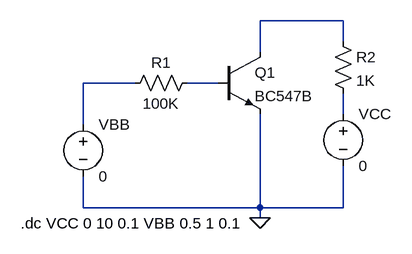
[diagram p0: schematic Common Emitter.asc]
Common Emitter.asc, the LTspice schematic file:
Version 4
SHEET 1 880 680
WIRE 608 192 480 192
WIRE 608 224 608 192
WIRE 480 240 480 192
WIRE 288 288 208 288
WIRE 416 288 368 288
WIRE 608 336 608 304
WIRE 208 352 208 288
WIRE 208 480 208 432
WIRE 480 480 480 336
WIRE 480 480 208 480
WIRE 608 480 608 416
WIRE 608 480 480 480
WIRE 480 496 480 480
FLAG 480 496 0
SYMBOL voltage 208 336 R0
SYMATTR InstName VBB
SYMATTR Value 0
SYMBOL voltage 608 320 R0
SYMATTR InstName VCC
SYMATTR Value 0
SYMBOL res 384 272 R90
WINDOW 0 0 56 VBottom 2
WINDOW 3 32 56 VTop 2
SYMATTR InstName R1
SYMATTR Value 100K
SYMBOL res 592 208 R0
SYMATTR InstName R2
SYMATTR Value 1K
SYMBOL npn 416 240 R0
SYMATTR InstName Q1
SYMATTR Value BC547B
TEXT 112 504 Left 2 !.dc VCC 0 10 0.1 VBB 0.5 1 0.1

The netlist it stands for:
* Common Emitter.asc
VBB N002 0 0
VCC N004 0 0
R1 N003 N002 100K
R2 N001 N004 1K
Q1 N001 N003 0 0 BC547B
.model NPN NPN
.model PNP PNP
.lib standard.bjt
.dc VCC 0 10 0.1 VBB 0.5 1 0.1
.backanno
.end